# Altium schematic sheet SH1 - POWER.SchDoc
size B
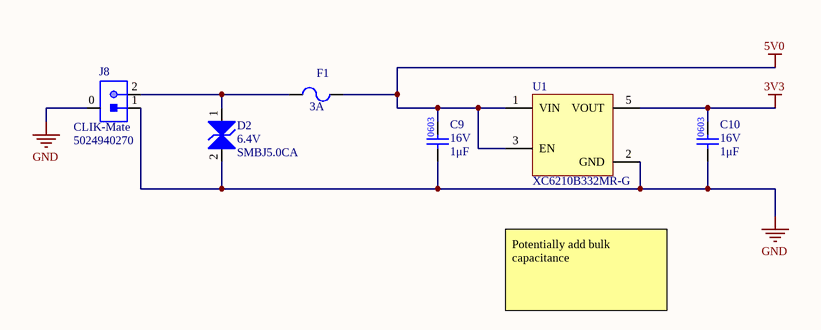
[diagram p0: SH1 - POWER.SchDoc]

## Parts
C9  value 1μF  Voltage Rating: 16V  [CAP0603]  (hidden comment: CAP_1uF_16V_0603)
C10  value 1μF  Voltage Rating: 16V  [CAP0603]  (hidden comment: CAP_1uF_16V_0603)
D2  Voltage - Breakdown (Min): 6.4V  Manufacturer Part Number 1: SMBJ5.0CA  [TVS_DIODE_BIDIR_SMB]  (hidden comment: TVS_DIODE_BIDIR_5V)
F1  FUSE_3A_0603  [FUSE_0603]  (value not drawn)
J8  Family: CLIK-Mate  Manufacturer Part Number 1: 5024940270  [MOLEX-5024940270]  (hidden comment: CON_2M_SM_RA)
U1  Manufacturer Part Number 1: XC6210B332MR-G  [SOT95P285X140-5N]  (hidden comment: LDO_3.3V_700mA)

## Nets
3V3: C10.2 U1.5(VOUT)
5V0: C9.2 F1.2 U1.1(VIN) U1.3(EN)
GND: C9.1 C10.1 D2.2 J8.0 J8.1 U1.2(GND)
NetD2_1: D2.1 F1.1 J8.2

## Notes on the sheet
- Potentially add bulk capacitance

## Library data of the parts
C9 C10 = CAP_1uF_16V_0603: CAP CER 1UF 16V Y5V 0603; Manufacturer 1: Yageo; Manufacturer Part Number 1: CC0603ZRY5V7BB105; Supplier Part Number 1: 311-1372-1-ND; Supplier 1: Digi-Key; Mounting Type: SMD; Package: 0603; Dielectric: Y5V
D2 = TVS_DIODE_BIDIR_5V: TVS DIODE 5V 9.2V SMB; Manufacturer 1: Littelfuse; Package/Footprint: SMB; Supplier Part Number 1: SMBJ5.0CALFCT-ND; Supplier 1: Digi-Key; Mounting Type: SMD; Voltage - Reverse Standoff (Typ): 5V; Voltage - Clamping (Max) @ Ipp: 9.2V; Verified: No; LCSC Part #: *
F1 = FUSE_3A_0603: FUSE SMD 3A 32V 0603; Manufacturer Part Number 1: 0467003.NR; Manufacturer 1: Littelfuse; Supplier Part Number 1: F1399CT-ND; Supplier 1: Digi-Key; Voltage Rating (DC): 32V; Current Rating: 3A
J8 = CON_2M_SM_RA: CONN HEADER SMD RIGHT ANGLE 2MM PITCH; Manufacturer 1: Molex; Supplier 1: Digi-Key; Supplier Part Number 1: WM15810CT-ND
U1 = LDO_3.3V_700mA: IC REG LINEAR 3.3V 700MA SOT25; Manufacturer 1: Diodes Incorporated; Input Voltage (Max): 6V; Voltage Dropout (Max): 0.075V; Package/Footprint: SOT-25; Output Voltage (Fixed): 3.3V; Output Current: 700mA; Operating Temperature: -40°C - 85°C; Mounting Type: SMD; Supplier 1: Digi-Key; Supplier Part Number 1: 893-1075-1-ND